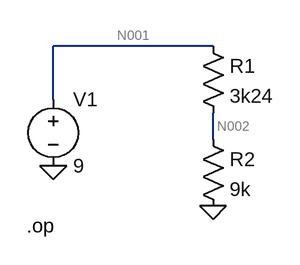
[diagram p0: schematic Draft2.asc]
Draft2.asc, the LTspice schematic file:
Version 4
SHEET 1 880 680
WIRE 208 48 16 48
WIRE 16 112 16 48
WIRE 208 160 208 128
FLAG 16 192 0
FLAG 208 240 0
DATAFLAG 208 48 "$-V(N002)"
DATAFLAG 208 160 ""
DATAFLAG 208 160 ""
DATAFLAG 208 160 ""
SYMBOL voltage 16 96 R0
SYMATTR InstName V1
SYMATTR Value 9
SYMBOL res 192 32 R0
SYMATTR InstName R1
SYMATTR Value 3k24
SYMBOL res 192 144 R0
SYMATTR InstName R2
SYMATTR Value 9k
TEXT -16 264 Left 2 !.op

The netlist it stands for:
* Draft2.asc
V1 N001 0 9
R1 N001 N002 3k24
R2 N002 0 9k
.op
.backanno
.end

* Results of the author's LTspice run, read from the files saved beside the schematic
* Operating Point:
*   V(n001) = 9 V
*   V(n002) = 6.618 V
*   I(R1) = 735.3 µA
*   I(R2) = 735.3 µA
*   I(V1) = -735.3 µA